# Altium schematic sheet PowerSupply.SchDoc
size A4; Author: Esteban Durán Madrid; CompanyName: Universidad de Santiago de Chile; Address1: Avenida Ecuador Nº 3519; Address2: Estación Central, Santiago; Address3: Chile; DocumentNumber: 2; SheetNumber: 2; SheetTotal: 3
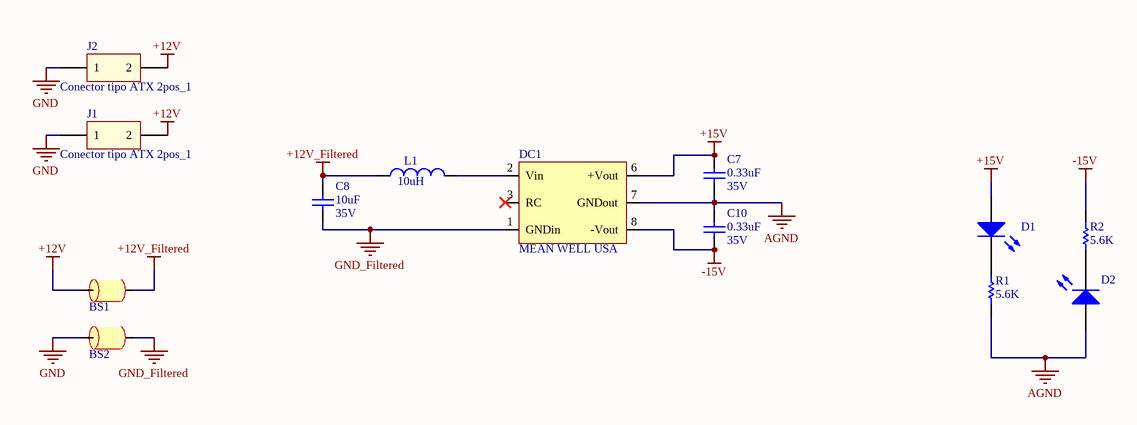
[diagram p0: PowerSupply.SchDoc]

## Parts
BS1  Ferrite bead  [RES_1206]  (value not drawn)
BS2  Ferrite bead  [RES_1206]  (value not drawn)
C7  0.33uF  Voltage: 35V  [CAP_0603]
C8  10uF  Voltage: 35V  [CAP_0805]
C10  0.33uF  Voltage: 35V  [CAP_0603]
D1  LED  [LED_0805_GREEN]  (value not drawn)
D2  LED  [LED_0805_GREEN]  (value not drawn)
DC1  MEAN WELL USA  [DC/DC +-15V 6W]
J1  Conector tipo ATX 2pos_1  [Conector tipo ATX Wurth 2 posiciones - (5.5mm)]
J2  Conector tipo ATX 2pos_1  [Conector tipo ATX Wurth 2 posiciones - (5.5mm)]
L1  10uH  [INDUCTOR_0805]
R1  5.6K  [RES_0805]
R2  5.6K  [RES_0805]

## Nets
+12V: BS1.1 J1.2 J2.2
+12V_Filtered: BS1.2 C8.1 L1.1
+15V: C7.1 D1.1(A) DC1.6(+Vout)
-15V: C10.2 DC1.8(-Vout) R2.2
AGND: C7.2 C10.1 D2.1(A) DC1.7(GNDout) R1.1
GND: BS2.1 J1.1 J2.1
GND_Filtered: BS2.2 C8.2 DC1.1(GNDin)
NetD1_2: D1.2(K) R1.2
NetD2_2: D2.2(K) R2.1
NetDC1_2: DC1.2(Vin) L1.2

Not connected (* = marked no-connect by the designer): DC1 3(RC)* 15(NC) 16(NC) 17(NC) 26(NC) 27(NC)

## Notes on the sheet
- Title
- Size:
- Date:
- A4
- Revision:
- Time:
- Sheet
- of
- Author:
- Project:

## Library data of the parts
BS1 BS2 = Bead: 4A; Manufacturer Part-Number: FBMJ3216HM600-T; Digikey Part-Number: 587-1770-1-ND
C7 C10 = Cap_0603: Capacitor Ceramic; Manufacturer Part-Number: CGA3E1X7R1V334K080AD; Digikey Part-Number: 445-9821-1-ND; Value: 0.33uF
C8 = Cap_0805: Capacitor; Manufacturer Part-Number: GRM21BC8YA106ME11L; Digikey Part-Number: 490-10505-1-ND; Value: 10uF
D1 D2 = LED2: LED Azul; Manufacturer Part-Number: 150080BS75000; Published: 8-Jun-2000; LatestRevisionDate: 17-Jul-2002; LatestRevisionNote: Re-released for DXP Platform.; PackageDocument: Feb-2002; PackageReference: 3.2X1.6X1.1; Publisher: Altium Limited; Digikey Part-Number: 732-4982-1-ND
DC1 = DC/DC +12V a +-15V 6W: Isolated Module DC DC Converter 2 Output 15V -15V 200mA, 200mA 9V - 36V Input; Manufacturer Part-Number: DPBW06F-15; Digikey Part-Number: 1866-1403-ND
J1 J2 = Conector tipo ATX 2pos_1: CONN HEADER VERT 2POS 5.5MM; Manufacturer Part-Number: 64900221122; Digikey Part-Number: 732-1927-ND
L1 = Inductor_0805: 500mA; Manufacturer Part-Number: MLZ2012N100LT000; Digikey Part-Number: 445-6762-1-ND; Value: 10uH
R1 R2 = Res0805: Manufacturer Part-Number: ERJ-P06J562V; Published: 8-Jun-2000; LatestRevisionDate: 17-Jul-2002; LatestRevisionNote: Re-released for DXP Platform.; PackageReference: AXIAL-0.3; Publisher: Altium Limited; PackageDescription: Axial Device, Thru-Hole; 2 Leads; 0.3 in Pin Spacing; Digikey Part-Number: P5.6KADCT-ND; Value: 5.6K